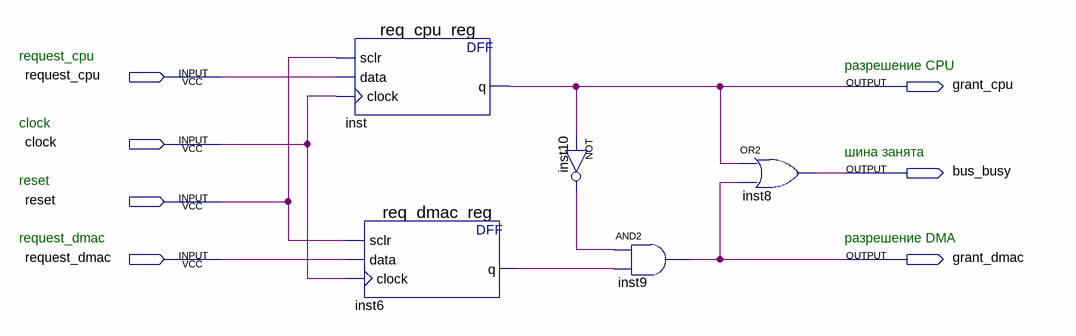
[diagram p0: schematic sheet]
// Quartus schematic bus_arbiter.bdf as structural Verilog: 5 symbols, 7 pins
module bus_arbiter (
  input  request_cpu,
  input  clock,
  input  reset,
  input  request_dmac,
  output grant_cpu,
  output bus_busy,
  output grant_dmac
);

  wire inst6_q, inst10_out;

  req_cpu_reg inst (.sclr(reset), .data(request_cpu), .clock(clock), .q(grant_cpu));
  req_dmac_reg inst6 (.sclr(reset), .data(request_dmac), .clock(clock), .q(inst6_q));
  not inst10 (inst10_out, grant_cpu);
  and inst9 (grant_dmac, inst10_out, inst6_q);
  or inst8 (bus_busy, grant_cpu, grant_dmac);

  // Notes on the sheet:
  //   request_cpu
  //   разрешение CPU
  //   clock
  //   шина занята
  //   reset
  //   request_dmac
  //   разрешение DMA
endmodule
